# Altium schematic sheet pca63519 - Codec.SchDoc: PCA63519 - Smart Remote 3 DK shield - Codec
size A4; DocumentNumber: 3; Revision: 1.2.1; SheetNumber: 3; SheetTotal: 6; DrawnBy: GETR; ProjectNumber: 4414; DocumentSize: A4; PCBRevision: 0049GETR; PCAName: PCA63519; PCBNumber: 400129
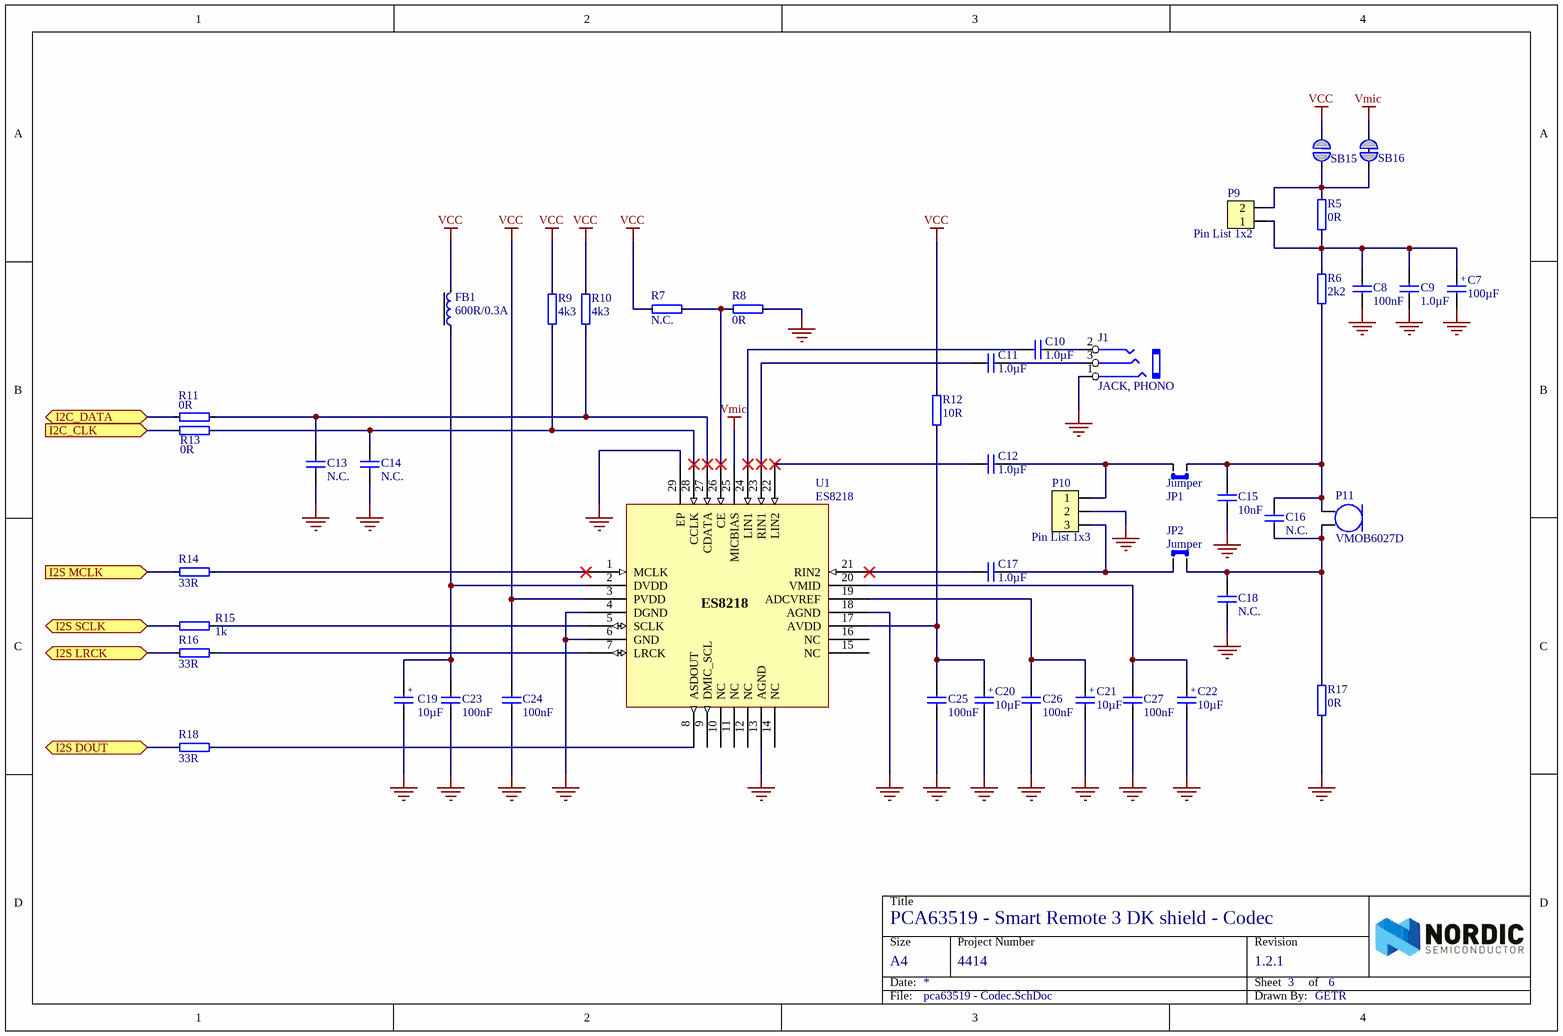
[diagram p0: pca63519 - Codec.SchDoc]

## Parts
C7  100µF  [CAPMP3528X21N]
C8  100nF  [CAPC1005X04L]
C9  1.0µF  [CAPC1005X04L]
C10  1.0µF  [CAPC1005X04L]
C11  1.0µF  [CAPC1005X04L]
C12  1.0µF  [CAPC1005X04L]
C13  N.C.  [CAPC1005X04L]
C14  N.C.  [CAPC1005X04L]
C15  10nF  [CAPC1005X04L]
C16  N.C.  [CAPC1005X04L]
C17  1.0µF  [CAPC1005X04L]
C18  N.C.  [CAPC1005X04L]
C19  10µF  [CAPMP3216X18N]
C20  10µF  [CAPMP3216X18N]
C21  10µF  [CAPMP3216X18N]
C22  10µF  [CAPMP3216X18N]
C23  100nF  [CAPC1005X04L]
C24  100nF  [CAPC1005X04L]
C25  100nF  [CAPC1005X04L]
C26  100nF  [CAPC1005X04L]
C27  100nF  [CAPC1005X04L]
FB1  600R/0.3A  [INDC1005X04L]
J1  JACK, PHONO  [SJ-3523-SMT-TR]
JP1  Jumper  [Jumper-2.54mm]
JP2  Jumper  [Jumper-2.54mm]
P9  Pin List 1x2  [LIST_1x2]
P10  Pin List 1x3  [LIST_1x3]
P11  VMOB6027D  [MIC_VMOB6027D]
R5  0R  [RESC1005X04L]
R6  2k2  [RESC1005X04L]
R7  N.C.  [RESC1005X04L]
R8  0R  [RESC1005X04L]
R9  4k3  [RESC1005X04L]
R10  4k3  [RESC1005X04L]
R11  0R  [RESC1005X04L]
R12  10R  [RESC1005X04L]
R13  0R  [RESC1005X04L]
R14  33R  [RESC1005X04L]
R15  1k  [RESC1005X04L]
R16  33R  [RESC1005X04L]
R17  0R  [RESC1005X04L]
R18  33R  [RESC1005X04L]
SB15  Solderbridge  [Solderbridge_0.4]  (value not drawn)  (no BOM)
SB16  Solderbridge  [Solderbridge_SHORTED_0.4]  (value not drawn)  (net tie, no BOM)
U1  ES8218  [QFN45P400X400X90_HS-29N]

## Ports
I2C_CLK (in), I2C_DATA (bidir), I2S DOUT (bidir), I2S LRCK (bidir), I2S MCLK (in), I2S SCLK (bidir)

## Nets
GND: C7.2 C8.1 C9.1 C13.1 C14.1 C15.1 C18.1 C19.2 C20.2 C21.2 C22.2 C23.1 C24.1 C25.1 C26.1 C27.1 J1.1(GND) P10.2 R8.1 R17.1 U1.4(DGND) U1.6(GND) U1.13(AGND) U1.18(AGND) U1.29(EP)
VCC: C24.2 FB1.2 R7.2 R9.2 R10.2 R12.2 SB15.1 U1.3(PVDD)
Vmic: SB16.1 U1.25(MICBIAS)
I2C_CLK: R13.1 ; port I2C_CLK
I2C_DATA: R11.1 ; port I2C_DATA
I2S DOUT: R18.1 ; port I2S DOUT
I2S LRCK: R16.1 ; port I2S LRCK
I2S MCLK: R14.1 ; port I2S MCLK
I2S SCLK: R15.2 ; port I2S SCLK
NetC7_1: C7.1 C8.2 C9.2 P9.1 R5.1 R6.2
NetC10_1: C10.1 J1.2(L)
NetC10_2: C10.2 U1.24(LIN1)
NetC11_1: C11.1 J1.3(R)
NetC11_2: C11.2 U1.23(RIN1)
NetC12_1: C12.1 JP1.2 P10.1
NetC12_2: C12.2 U1.22(LIN2)
NetC13_2: C13.2 R10.1 R11.2 U1.27(CDATA)
NetC14_2: C14.2 R9.1 R13.2 U1.28(CCLK)
NetC15_2: C15.2 C16.2 JP1.1 P11.1(POWER/OUT) R6.1
NetC16_1: C16.1 C18.2 JP2.2 P11.2(GND) R17.2
NetC17_1: C17.1 JP2.1 P10.3
NetC17_2: C17.2 U1.21(RIN2)
NetC19_1: C19.1 C23.2 FB1.1 U1.2(DVDD)
NetC20_1: C20.1 C25.2 R12.1 U1.17(AVDD)
NetC21_1: C21.1 C26.2 U1.19(ADCVREF)
NetC22_1: C22.1 C27.2 U1.20(VMID)
NetP9_2: P9.2 R5.2 SB15.2 SB16.2
NetR7_1: R7.1 R8.2 U1.26(CE)
NetR14_2: R14.2 U1.1(MCLK)
NetR15_1: R15.1 U1.5(SCLK)
NetR16_2: R16.2 U1.7(LRCK)
NetR18_2: R18.2 U1.8(ASDOUT)

Not connected (* = marked no-connect by the designer): U1 9(DMIC_SCL) 10(NC) 11(NC) 12(NC) 14(NC) 15(NC) 16(NC)

## Notes on the sheet
- Title
- Size
- Date:
- Project Number
- Sheet         of
- Revision
- File:
- Drawn By:
- (in symbol C1206-10µ_Tantal) +
- (in symbol C3528-100µF) +

## Library data of the parts
C7 = C3528-100µF: Capacitor, Tantalum, ±10%; Manufacturer: Vishay Sprague; Manufacturer Part Number: TR3B107K6R3C0500; Note: 6.3V; Artikkelnr Noca: N.A.; Part Number: C3528-100µF; Datasheet: http://www.farnell.com/datasheets/438325.pdf; Footprint Doc: 3528; LatestRevisionDate: 2013-06-05; Pin Count: 2; Publisher: Nordic Semiconductor; Published: 2010-10-26; Value: 100µF; Supplier: Farnell; Supplier part number: 175-4047; 2nd source Supplier: *; 2nd source part number: *; Artikkelnr Simpro: N.A.
C8 C23-C27 = C0402-100n: Capacitor, X7R, ±10%; Note: 16V; Artikkelnr Noca: 20039200; Artikkelnr Simpro: N.A.; Part Number: C0402-100n; Manufacturer: *; Manufacturer Part Number: *; Datasheet: *; Footprint Doc: 0402; LatestRevisionDate: 2009-11-23; Pin Count: 2; Publisher: Nordic Semiconductor; Published: 2009-05-08; Value: 100nF; Supplier: *; Supplier part number: *; 2nd source Supplier: *; 2nd source part number: *
C9-C12 C17 = C0402-1µ0: Capacitor, X5R, ±5%; Note: 6.3V; Artikkelnr Noca: 20039235; Artikkelnr Simpro: N.A.; Part Number: C0402-1µ0; Manufacturer: *; Manufacturer Part Number: *; Datasheet: *; Footprint Doc: 0402; LatestRevisionDate: 2016-08-22; Pin Count: 2; Publisher: Nordic Semiconductor; Published: 2009-05-08; Value: 1.0µF; Supplier: Digi-Key; Supplier part number: 1276-1444-1-ND; 2nd source Supplier: *; 2nd source part number: *
C13 C14 C16 C18 = C0402-N.C.: Not mounted; Note: Chip Cap; Artikkelnr Noca: N.A.; Assembly: Not mounted; Part Number: C0402-N.C.; Manufacturer: *; Manufacturer Part Number: *; Datasheet: *; Footprint Doc: 0402; LatestRevisionDate: 2009-05-08; Pin Count: 2; Publisher: Nordic Semiconductor; Published: 2009-05-08; Value: N.C.; Supplier: *; Supplier part number: *; 2nd source Supplier: *; 2nd source part number: *; Artikkelnr Simpro: N.A.
C15 = C0402-10n: Capacitor, X7R, ±10%; Note: 16V; Artikkelnr Noca: 20039166; Artikkelnr Simpro: N.A.; Part Number: C0402-10n; Manufacturer: *; Manufacturer Part Number: *; Datasheet: *; Footprint Doc: 0402; LatestRevisionDate: 2009-11-23; Pin Count: 2; Publisher: Nordic Semiconductor; Published: 2009-05-08; Value: 10nF; Supplier: *; Supplier part number: *; 2nd source Supplier: *; 2nd source part number: *
C19-C22 = C1206-10µ_Tantal: Capacitor, Tantalum, ±10%; Note: 16V; Artikkelnr Noca: N.A.; Part Number: C1206-10µ_Tantal; Manufacturer: *; Manufacturer Part Number: *; Datasheet: *; Footprint Doc: 1206; LatestRevisionDate: 2013-12-17; Pin Count: 2; Publisher: Nordic Semiconductor; Published: 2011-01-17; Value: 10µF; Supplier: Digi-Key; Supplier part number: 399-8269-1-ND; 2nd source Supplier: *; 2nd source part number: *; Artikkelnr Simpro: N.A.
FB1 = FB0402-600R@100MHz-300mA: Ferrite Bead, 600 Ohm @ 100MHz, 300mA, 600 mOhm Max; Manufacturer: Murata; Manufacturer Part Number: BLM15AG601SN1D; 2nd source part number: 490-1006-1-ND; Note: Chip EMIFIL Inductor Type Chip Ferrite Bead; Artikkelnr Noca: 33029424; Artikkelnr Simpro: N.A.; Part Number: FB0402-600R@100MHz-300mA; Datasheet: http://www.farnell.com/datasheets/5144.pdf; Footprint Doc: 0402; LatestRevisionDate: 2014-01-10; Pin Count: 2; Publisher: Nordic Semiconductor; Published: 2011-09-18; Value: 600R/0.3A; Supplier: Farnell; Supplier part number: 151-5762; 2nd source Supplier: Digi-Key
J1 = SJ-3523-SMT-TR: CONN AUDIO JACK 3.5MM STEREO SMD; Manufacturer: CUI Inc.; Artikkelnr Noca: N.A.; Part Number: SJ-3523-SMT-TR; Manufacturer Part Number: SJ-3523-SMT-TR; Datasheet: http://www.cui.com/product/resource/digikeypdf/sj-352x-smt_series.pdf; Footprint Doc: SJ-3523-SMT-TR; LatestRevisionDate: 2014-12-15; Pin Count: 3; Publisher: Nordic Semiconductor; Published: 2014-12-15; Value: JACK, PHONO; Note: *; Supplier: Digi-Key; Supplier part number: CP-3523SJCT-ND; 2nd source Supplier: *; 2nd source part number: *; Artikkelnr Simpro: N.A.
JP1 JP2 = Jumper-2.54mm: Jumper - 2.54mm; Artikkelnr Noca: 56019040; Artikkelnr Simpro: N.A.; Part Number: Jumper-2.54mm; Manufacturer: *; Manufacturer Part Number: *; Datasheet: *; Footprint Doc: Jumper-2.54mm; LatestRevisionDate: 2009-12-12; Pin Count: 2; Publisher: Nordic Semiconductor; Published: 2009-12-12; Value: Jumper; Note: Jumper; Supplier: *; Supplier part number: *; 2nd source Supplier: *; 2nd source part number: *
P9 = Pin List 1x2: Pin List 1x2, 2.54mm (100mil); Artikkelnr Noca: 56019040; Artikkelnr Simpro: N.A.; Part Number: Pin List 1x2; Manufacturer: *; Manufacturer Part Number: *; Datasheet: *; Footprint Doc: LIST_1x2; LatestRevisionDate: 2009-12-12; Pin Count: 2; Publisher: Nordic Semiconductor; Published: 2009-12-12; Value: Pin List 1x2; Note: *; Supplier: *; Supplier part number: *; 2nd source Supplier: *; 2nd source part number: *
P10 = Pin List 1x3: Pin List 1x3, 2.54mm (100mil); Artikkelnr Noca: 56019041; Artikkelnr Simpro: N.A.; Part Number: Pin List 1x3; Manufacturer: *; Manufacturer Part Number: *; Datasheet: *; Footprint Doc: LIST_1x3; LatestRevisionDate: 2009-12-12; Pin Count: 3; Publisher: Nordic Semiconductor; Published: 2009-12-12; Value: Pin List 1x3; Note: *; Supplier: *; Supplier part number: *; 2nd source Supplier: *; 2nd source part number: *
P11 = VMOB6027D-423G-PAHRAC-00-0: Omnidirectional Back Electret Condenser Microphone; Manufacturer: VECO; Artikkelnr Noca: N.A.; Part Number: VMOB6027D-423G-PAHRAC-00-0; Manufacturer Part Number: VMOB6027D-423G-PAHRAC-00-0; Datasheet: C:\Datasheets\VECO\VMOB6027D.pdf; Footprint Doc: MIC_VMOB6027D; LatestRevisionDate: 2016-01-18; Pin Count: 2; Publisher: Nordic Semiconductor; Published: 2014-07-29; Value: VMOB6027D; Note: *; Supplier: *; Supplier part number: *; 2nd source Supplier: *; 2nd source part number: *; Artikkelnr Simpro: N.A.
R5 R8 R11 R13 R17 = R0402-0R: Resistor, ±5%, 0.063W; Note: Chip Res 5%; Artikkelnr Noca: 27049000; Artikkelnr Simpro: N.A.; Value Ohm: 0; Part Number: R0402-0R; Manufacturer: *; Manufacturer Part Number: *; Datasheet: *; Footprint Doc: 0402; LatestRevisionDate: 2009-11-23; Pin Count: 2; Publisher: Nordic Semiconductor; Published: 2009-05-08; Value: 0R; Supplier: Farnell; Supplier part number: 146-9661; 2nd source Supplier: *; 2nd source part number: *
R6 = R0402-2k2: Resistor, ±1%, 0.063W; Note: Chip Res 1%; Artikkelnr Noca: 27049081; Artikkelnr Simpro: N.A.; Value Ohm: 2200; Part Number: R0402-2k2; Manufacturer: *; Manufacturer Part Number: *; Datasheet: *; Footprint Doc: 0402; LatestRevisionDate: 2009-11-23; Pin Count: 2; Publisher: Nordic Semiconductor; Published: 2009-05-08; Value: 2k2; Supplier: Farnell; Supplier part number: 173-8854; 2nd source Supplier: *; 2nd source part number: *
R7 = R0402-N.C.: Not mounted; Note: Chip Res; Artikkelnr Noca: N.A.; Assembly: Not mounted; Part Number: R0402-N.C.; Manufacturer: *; Manufacturer Part Number: *; Datasheet: *; Footprint Doc: 0402; LatestRevisionDate: 2009-05-08; Pin Count: 2; Publisher: Nordic Semiconductor; Published: 2009-05-08; Value: N.C.; Supplier: *; Supplier part number: *; 2nd source Supplier: *; 2nd source part number: *; Artikkelnr Simpro: N.A.
R9 R10 = R0402-4k3: Resistor, ±1%, 0.063W; Manufacturer: Yageo; Manufacturer Part Number: RC0402FR-074K3L; Note: Chip Res 1%; Artikkelnr Noca: N.A.; Value Ohm: 4300; Part Number: R0402-4k3; Datasheet: http://www.yageo.com/NewPortal/yageodocoutput?fileName=/pdf/R-Chip/PYu-RC_Group_51_RoHS_L_3.pdf; Footprint Doc: 0402; LatestRevisionDate: 2015-09-07; Pin Count: 2; Publisher: Nordic Semiconductor; Published: 2015-09-07; Value: 4k3; Supplier: Digi-Key; Supplier part number: 311-4.30KLRCT-ND; 2nd source Supplier: *; 2nd source part number: *; Artikkelnr Simpro: N.A.
R12 = R0402-10R: Resistor, ±1%, 0.063W; Note: Chip Res 1%; Artikkelnr Noca: 27049025; Artikkelnr Simpro: N.A.; Value Ohm: 10; Part Number: R0402-10R; Manufacturer: *; Manufacturer Part Number: *; Datasheet: *; Footprint Doc: 0402; LatestRevisionDate: 2009-11-23; Pin Count: 2; Publisher: Nordic Semiconductor; Published: 2009-05-08; Value: 10R; Supplier: Farnell; Supplier part number: 173-8824; 2nd source Supplier: *; 2nd source part number: *
R14 R16 R18 = R0402-33R: Resistor, ±1%, 0.063W; Note: Chip Res 1%; Artikkelnr Noca: 27049037; Artikkelnr Simpro: N.A.; Value Ohm: 33; Part Number: R0402-33R; Manufacturer: *; Manufacturer Part Number: *; Datasheet: *; Footprint Doc: 0402; LatestRevisionDate: 2009-11-23; Pin Count: 2; Publisher: Nordic Semiconductor; Published: 2009-05-08; Value: 33R; Supplier: Farnell; Supplier part number: 173-8830; 2nd source Supplier: *; 2nd source part number: *
R15 = R0402-1k0: Resistor, ±1%, 0.063W; Note: Chip Res 1%; Artikkelnr Noca: 27049073; Artikkelnr Simpro: N.A.; Value Ohm: 1000; Part Number: R0402-1k0; Manufacturer: *; Manufacturer Part Number: *; Datasheet: *; Footprint Doc: 0402; LatestRevisionDate: 2009-11-23; Pin Count: 2; Publisher: Nordic Semiconductor; Published: 2009-05-08; Value: 1k; Supplier: Farnell; Supplier part number: 173-8850; 2nd source Supplier: *; 2nd source part number: *
SB15 = Solderbridge 0.4mm: Artikkelnr Noca: N.A.; Part Number: Solderbridge 0.4mm; Manufacturer: *; Manufacturer Part Number: *; Datasheet: *; Footprint Doc: Solderbridge; LatestRevisionDate: 2009-12-14; Pin Count: 2; Publisher: Nordic Semiconductor; Published: 2009-12-14; Value: Solderbridge; Note: *; Supplier: *; Supplier part number: *; 2nd source Supplier: *; 2nd source part number: *; Artikkelnr Simpro: N.A.
SB16 = Solderbridge Shorted 0.4mm: Shorted Solderbridge; Artikkelnr Noca: N.A.; Part Number: Solderbridge Shorted 0.4mm; Manufacturer: *; Manufacturer Part Number: *; Datasheet: *; Footprint Doc: Solderbridge_Shorted; LatestRevisionDate: 2012-08-07; Pin Count: 2; Publisher: Nordic Semiconductor; Published: 2012-08-07; Value: Solderbridge; Note: *; Supplier: *; Supplier part number: *; 2nd source Supplier: *; 2nd source part number: *; Artikkelnr Simpro: N.A.
U1 = ES8218: High performance, low power and low cost audio ADC. It consists of 2-ch ADC, microphone amplifier and auto level control; Manufacturer: Everest Semiconductor; Artikkelnr Noca: N.A.; Part Number: ES8218; Manufacturer Part Number: ES8218; Datasheet: http://projecttools.nordicsemi.no/confluence/download/attachments/10067496/Everest+ES8288+DS.pdf?version=1&modificationDate=1369290839060; Footprint Doc: QFN-28; LatestRevisionDate: 2014-07-10; Pin Count: 29; Publisher: Nordic Semiconductor; Published: 2014-07-03; Value: ES8218; Note: *; Supplier: *; Supplier part number: *; 2nd source Supplier: *; 2nd source part number: *; Artikkelnr Simpro: N.A.